# EAGLE design schematic (EAGLE 8.3.2)
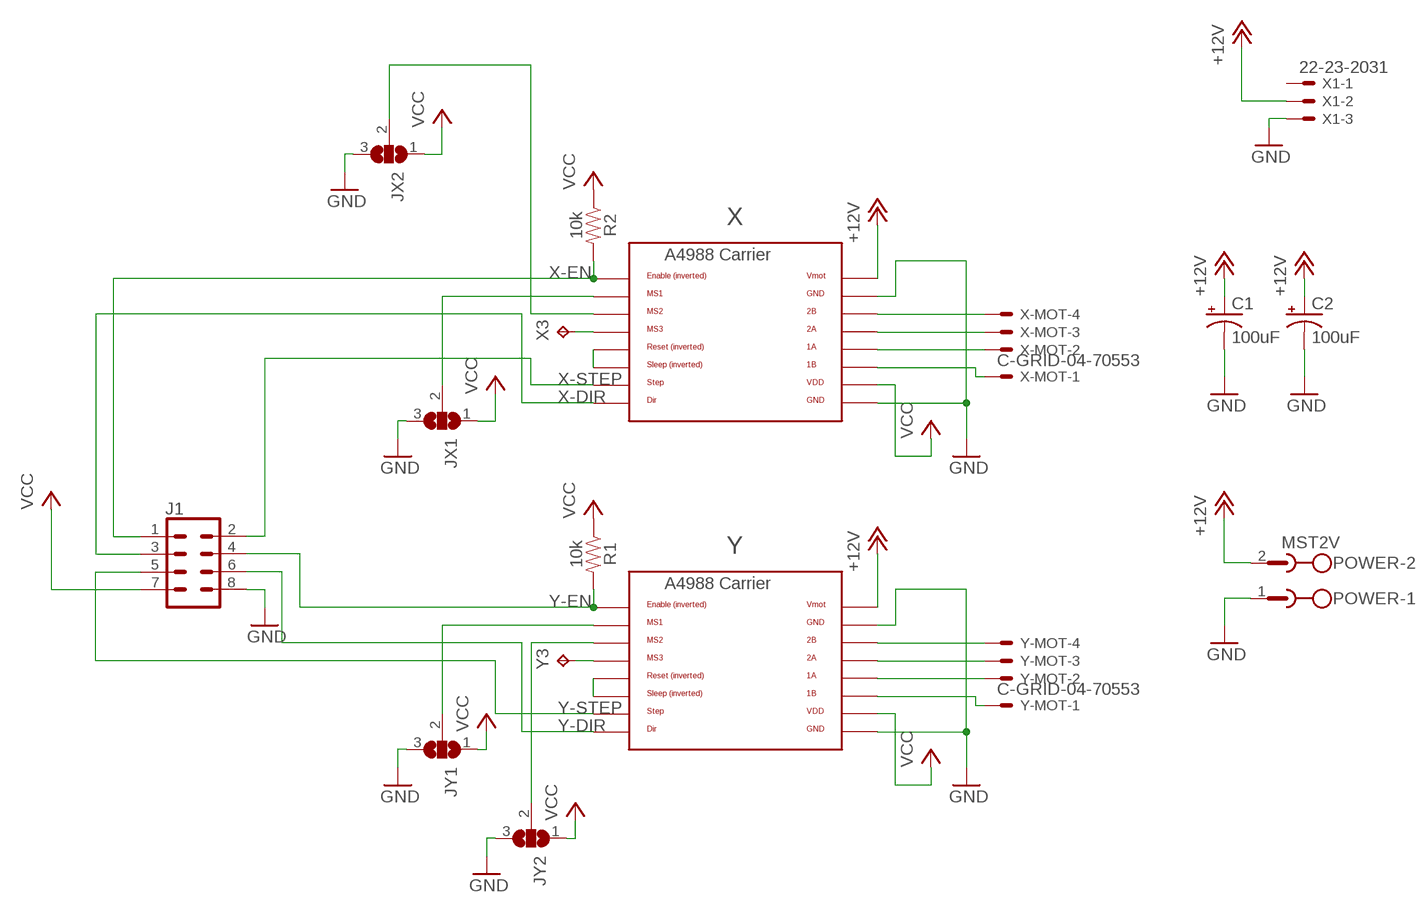
[diagram p0: schematic, sheet 1]

## Parts
C1  100uF  100UF-POLAR-RADIAL-2.5MM-25V-20%  [CPOL-RADIAL-2.5MM-6.5MM]
C2  100uF  100UF-POLAR-RADIAL-2.5MM-25V-20%  [CPOL-RADIAL-2.5MM-6.5MM]
J1  CONN_04X2  [2X4]
JX1  SJ2W  [SJ_2]
JX2  SJ2W  [SJ_2]
JY1  SJ2W  [SJ_2]
JY2  SJ2W  [SJ_2]
POWER  MST2V  [MSTBV2]
R1  10k  10KOHM-HORIZ-1/4W-1%  [AXIAL-0.3]
R2  10k  10KOHM-HORIZ-1/4W-1%  [AXIAL-0.3]
U$1  A4988BREAKOUT  [A4988BREAKOUT]
U$4  A4988BREAKOUT  [A4988BREAKOUT]
X1  22-23-2031  [22-23-2031]
X3  TPB1,27  [B1,27]
X-MOT  C-GRID-04-70553  [70553-04]
Y3  TPB1,27  [B1,27]
Y-MOT  C-GRID-04-70553  [70553-04]

## Nets
+12V: C1.1(+) C2.1(+) POWER.2 U$1.VMOT U$4.VMOT X1.2
GND: C1.2(-) C2.2(-) J1.8 JX1.3 JX2.3 JY1.3 JY2.3 POWER.1 U$1.GND U$1.GND@0(GND) U$4.GND U$4.GND@0(GND) X1.3
N$1: JY2.2 U$4.MS2
N$2: U$4.MS3 Y3.TP
N$3: U$4.2B Y-MOT.4
N$4: U$4.2A Y-MOT.3
N$5: U$1.RST U$1.SLP(SLEEP)
N$6: U$1.2B X-MOT.4
N$7: U$1.2A X-MOT.3
N$8: U$4.RST U$4.SLP(SLEEP)
N$9: U$1.1A X-MOT.2
N$10: U$4.1A Y-MOT.2
N$11: U$4.1B Y-MOT.1
N$12: U$1.1B X-MOT.1
N$13: JX2.2 U$1.MS2
N$14: U$1.MS3 X3.TP
N$15: JX1.2 U$1.MS1
N$16: JY1.2 U$4.MS1
VCC: J1.7 JX1.1 JX2.1 JY1.1 JY2.1 R1.P$1 R2.P$1 U$1.VDD U$4.VDD
X-DIR: J1.3 U$1.DIR
X-EN: J1.1 R2.P$2 U$1.EN
X-STEP: J1.2 U$1.STEP
Y-DIR: J1.6 U$4.DIR
Y-EN: J1.4 R1.P$2 U$4.EN
Y-STEP: J1.5 U$4.STEP
Unconnected: X1.1

## Notes on the sheet
- X
- Y

## Library data of the parts
C1 C2 = SparkFun-Capacitors:100UF-POLAR: 100µF polarized capacitors A capacitor is a passive two-terminal electrical component used to store electrical energy temporarily in an electric field.; PROD_ID: CAP-08439
J1 = SparkFun-Connectors:CONN_04X2: Multi connection point. Often used as Generic Header-pin footprint for 0.1 inch spaced/style header connections On any of the 0.1 inch spaced packages, you can populate with these: Break Away Headers - Straight <https://www.sparkfun.com/products/116> (PRT-00116) Break Away Male Headers - Right Angle <https://www.sparkfun.com/products/553> (PRT-00553) Female Headers <https://www.sparkfun.com/products/115> (PRT-00115) Break Away Headers - Machine Pin <https://www.sparkfun.com/products/117> (PRT-00117) Break Away Female Headers - Swiss Machine Pin <https://www.sparkfun.com/products/743> (PRT-00743)
JX1 JX2 JY1 JY2 = jumper:SJ2W: SMD solder JUMPER
POWER = con-phoenix-508:MST2V: PHOENIX; OC_FARNELL: unknown; OC_NEWARK: unknown
R1 R2 = SparkFun-Resistors:10KOHM: 10kΩ resistor A resistor is a passive two-terminal electrical component that implements electrical resistance as a circuit element. Resistors act to reduce current flow, and, at the same time, act to lower voltage levels within circuits. - Wikipedia; PROD_ID: RES-12183
U$1 U$4 = RepRapjr:A4988BREAKOUT
X1 = con-molex:22-23-2031: .100" (2.54mm) Center Header - 3 Pin; MF: MOLEX; MPN: 22-23-2031; OC_FARNELL: 1462950; OC_NEWARK: 30C0862
X3 Y3 = testpad:TP: Test pad
X-MOT Y-MOT = con-molex:C-GRID-04: CONNECTOR wire to board 2.54 mm (0.100") pitch header; OC_FARNELL: unknown; OC_NEWARK: unknown

## Board
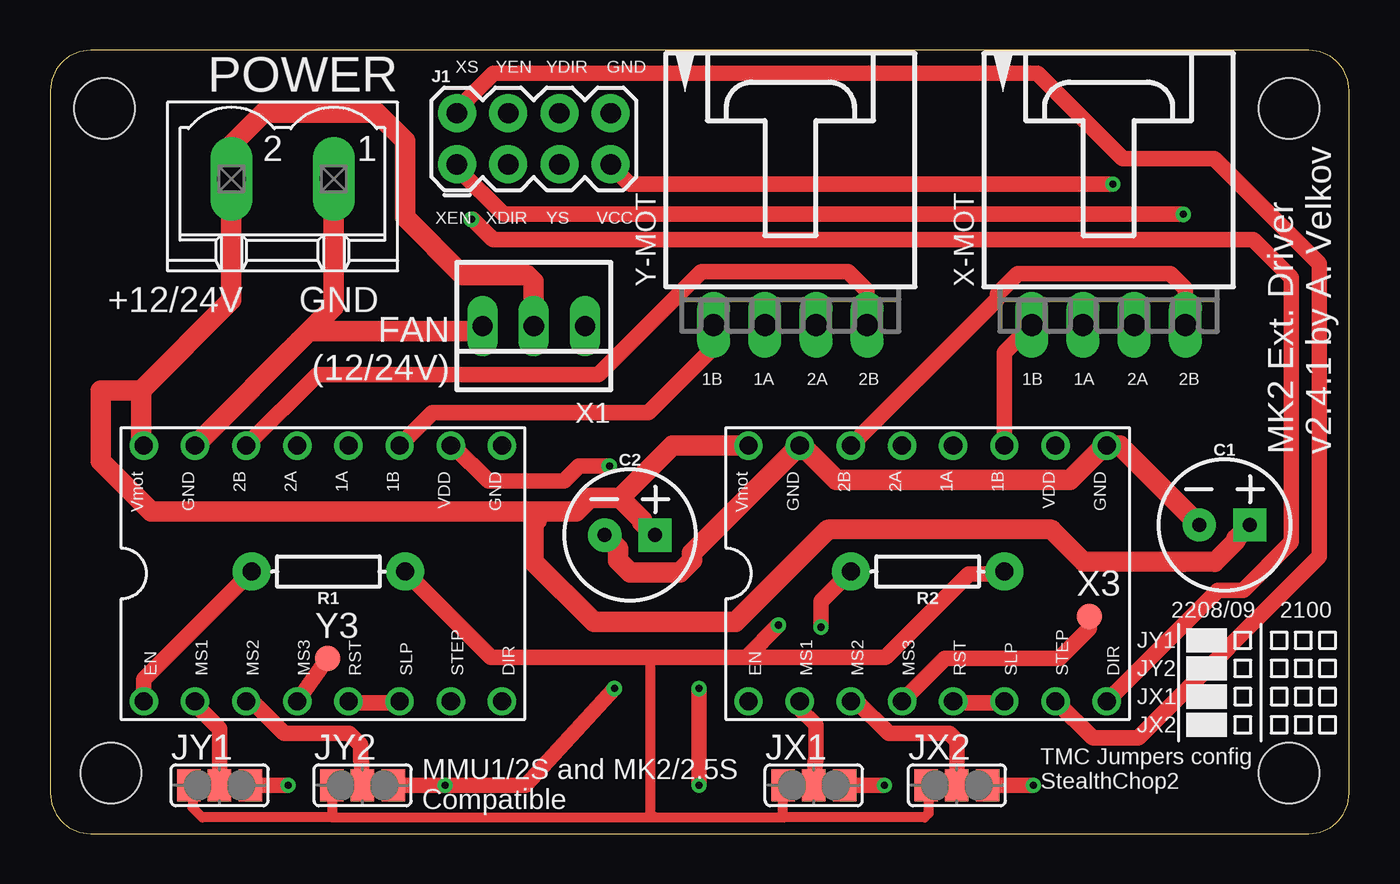
[diagram p1: board, top side]
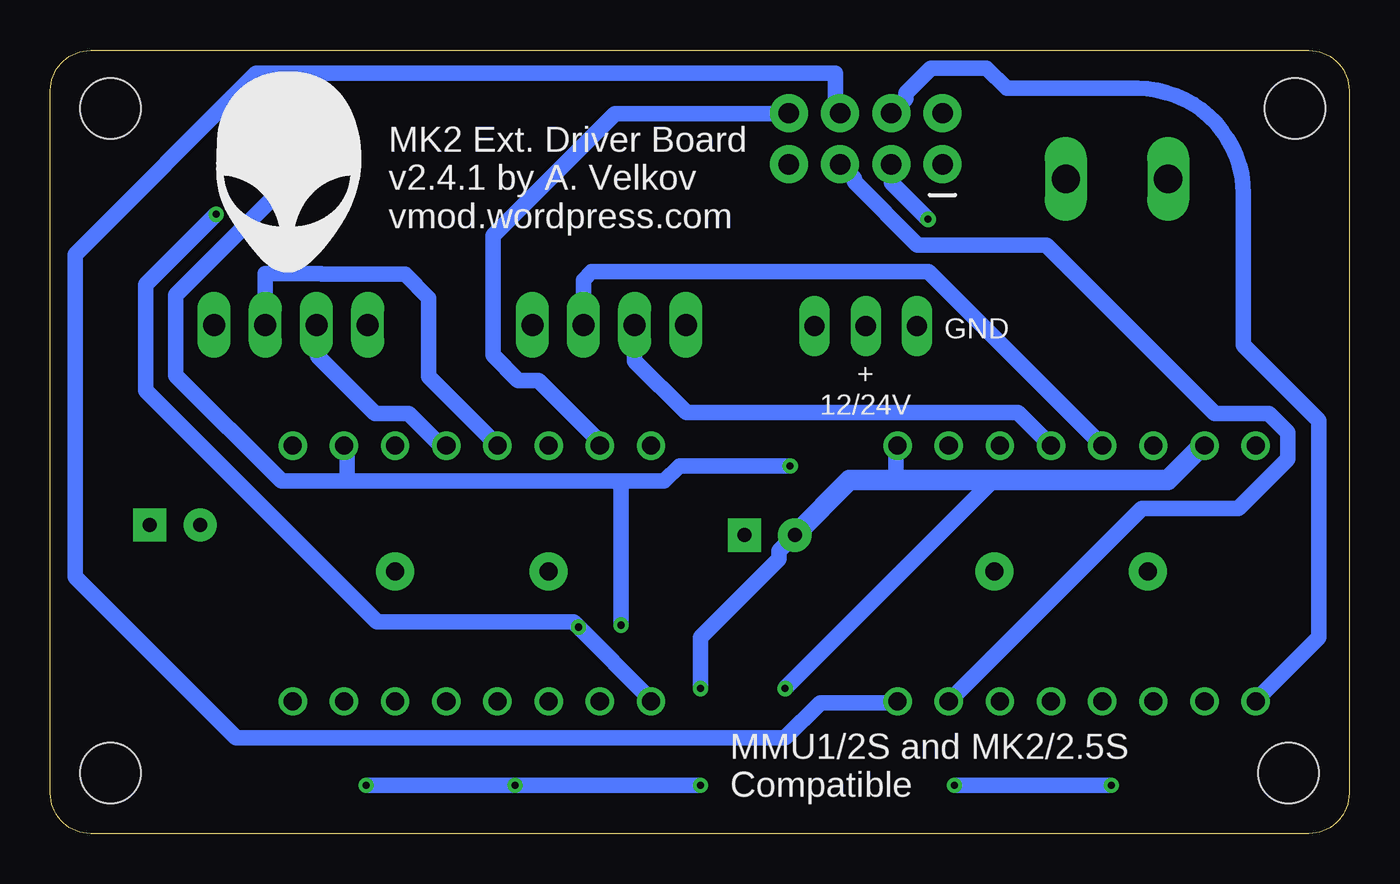
[diagram p2: board, bottom side, seen from below]

Size 64.48 x 38.89 mm. Coordinates in mm from the lower left corner, seen from the top.
Outline: 0,36.89 0,2 arc90 2,0 62.48,0 arc90 64.48,2 64.48,36.89 arc90 62.48,38.89 2,38.89 arc90 0,36.89
Copper layers (1*16): Top 0.035mm / dielectric 1.5mm / Bottom 0.035mm
Design rules "default *": minimum track width 30mil, minimum drill 0.35mm, track to track 20mil, track to pad 20mil, pad to pad 20mil, via to via 20mil, smd to smd 20mil, copper to edge 20mil, drill to drill 20mil, minimum pad ring 10mil, minimum via ring 8mil, stop-mask expansion 4mil, vias tented up to drill 20mil, thermal gap 10mil
Holes 3 mm at 3,3 61.5,36 2.67,36 61.5,3

### Footprints (pad centres in the part's own frame; a part is rotated, then mirrored left to right if it is on the bottom)
CPOL-RADIAL-2.5MM-6.5MM = drill 0.7 pad 1.651 square: 1 1.25,0 | drill 0.7 pad 1.651: 2 -1.25,0
2X4 = drill 1.016 pad 1.88: 1 -3.81,-1.27; 2 -3.81,1.27; 3 -1.27,-1.27; 4 -1.27,1.27; 5 1.27,-1.27; 6 1.27,1.27; 7 3.81,-1.27; 8 3.81,1.27
SJ_2 = smd 1.168 x 1.6: 1 -1.524,0; 2 0,0; 3 1.524,0
MSTBV2 = drill 1.397 long: 1 -2.54,0; 2 2.54,0
AXIAL-0.3 = drill 0.9 pad 1.88: P$1 -3.81,0; P$2 3.81,0
A4988BREAKOUT = drill 0.9: 1A 8.89,1.27; 1B 11.43,1.27; 2A 6.35,1.27; 2B 3.81,1.27; DIR 16.51,-11.43; EN -1.27,-11.43; GND 16.51,1.27; GND@0 1.27,1.27; MS1 1.27,-11.43; MS2 3.81,-11.43; MS3 6.35,-11.43; RST 8.89,-11.43; SLP 11.43,-11.43; STEP 13.97,-11.43; VDD 13.97,1.27; VMOT -1.27,1.27
22-23-2031 = drill 1 long: 1 -2.54,0; 2 0,0; 3 2.54,0
B1,27 = smd 1.27 x 1.27: TP 0,0
70553-04 = drill 1.092 long: 1 -3.81,-7.62; 2 -1.27,-7.62; 3 1.27,-7.62; 4 3.81,-7.62

### Placement (x,y rotation side)
C1  58.29,15.32 0 top
C2  28.77,14.82 0 top
J1  24,34.5 0 top
JX1  37.9,2.4 0 top
JX2  45,2.4 0 top
JY1  8.4,2.4 0 top
JY2  15.5,2.4 0 top
POWER  11.53,32.51 180 top
R1  13.8,13.01 180 top
R2  43.55,13.01 180 top
U$1  35.93,18 0 top
U$4  5.91,18 0 top
X1  24,25.2 180 top
X3  51.58,10.79 0 top
X-MOT  52.53,32.87 0 top
Y3  13.76,8.69 0 top
Y-MOT  36.74,32.87 0 top

### Tracks (layer width: path | path; a pad name or v marks a point on that pad's centre or on a via)
+12V
  Top 0.762: 24.25,16 24.25,15.5
  Top 1: C1.1 58.87,14.65 58.87,14.56 57.8,13.49 56.28,13.49 56.27,13.5 51.3,13.5 49.7,15.1 38.6,15.1 38.5,15
  Top 1.016: 4.5,22 8.98,26.48 POWER.2 8.98,34.19 10.6,35.8 16.2,35.8 17.6,34.4 17.6,30.6 20.48,27.72 23.68,27.72 24,27.4 X1.2 | 4.5,22 4.5,19.41 U$4.VMOT | 4.5,22 2.5,22 2.5,18.5 5,16 24,16 | 24,16 24.25,16 26.1,16 26.76,16.66 28.28,16.66 | 28.28,16.66 29.36,15.58 29.36,15.48 C2.1 | 28.28,16.66 30.89,19.27 U$1.VMOT | 24,16 24,13.5 27,10.5 34,10.5 38.5,15
GND  (via drill 0.35)
  Top 0.762: v28,7.2 23.6,2.4 v19.6,2.4 JY2.3 | JY1.3 v11.8,2.4 | v32.2,7.2 v32.2,2.4 | v41.4,2.4 JX1.3 | JX2.3 v48.8,2.4
  Top 1.016: C2.2 28.18,14.16 28.18,13.57 28.77,12.98 31.27,12.98 31.86,13.57 31.86,13.93 U$1.GND@0 37.31,19.27 39.03,17.55 50.61,17.55 52.33,19.27 U$1.GND 53.09,19.27 C1.2 | POWER.1 14.06,26.15 12.86,24.94 | 12.86,24.94 U$4.GND@0 | X1.3 21.46,24.94 12.86,24.94
  Bottom 0.762: 22.5,17.55 22.5,19.25 U$4.GND | J1.8 28,35.75 36.45,35.75 42.5,29.7 42.5,23.75 41.25,22.5 40.25,22.5 37.25,19.5 U$1.GND@0 | 9.01,17.55 17.66,17.55 v28,7.2 | v11.8,2.4 v19.6,2.4 | C2.2 28.3,14.03 28.3,13.63 32.2,9.73 v32.2,7.2 | v32.2,2.4 v41.4,2.4 v48.8,2.4
  Bottom 1.016: U$4.GND@0 7.29,19.27 9.01,17.55 22.5,17.55 24.8,17.55 C2.2
N$1
  Top 0.762: U$4.MS2 10.01,6.57 11.6,4.97 14.83,4.97 15.4,4.4 15.4,3.62 15.45,3.57 15.45,2.45 JY2.2
N$2
  Top 0.762: U$4.MS3 12.96,7.59 Y3.TP
N$3
  Top 0.762: U$4.2B 13.26,22.8 27.22,22.8 32.32,27.9 39.6,27.9 40.55,26.95 Y-MOT.4
N$4
  Bottom 0.762: U$4.2A 20.89,27.9 37.6,27.9 38.01,27.49 Y-MOT.3
N$5
  Top 0.762: U$1.RST 45,6.5 47.25,6.5 U$1.SLP
N$6
  Top 0.762: U$1.2B 47.02,26.54 47.02,26.78 48.04,27.8 55.6,27.8 56.34,27.05 X-MOT.4
N$7
  Bottom 0.762: U$1.2A 45.7,22.68 45.7,26.6 46.88,27.78 51,27.78 51.02,27.8 53.8,27.8 X-MOT.3
N$8
  Top 0.762: U$4.RST 15,6.5 17.25,6.5 U$4.SLP
N$9
  Bottom 0.762: U$1.1A 45.11,19.27 46.7,20.86 48.36,20.86 51.2,23.7 51.2,25.18 X-MOT.2
N$10
  Bottom 0.762: U$4.1A 16.43,20.9 32.9,20.9 35.47,23.47 Y-MOT.2
N$11
  Top 0.762: U$4.1B 18.98,20.9 29.7,20.9 32.93,24.13 Y-MOT.1
N$12
  Top 0.762: U$1.1B 47.36,23.89 X-MOT.1
N$13
  Top 0.762: U$1.MS2 40.03,6.57 41.62,4.97 44.63,4.97 45,4.6 JX2.2
N$14
  Top 0.762: U$1.MS3 44.41,8.7 50.1,8.7 51.58,10.18 X3.TP
N$15
  Top 0.762: U$1.MS1 37.2,6.2 38,5.4 38,3.62 37.95,3.57 37.95,2.45 JX1.2
N$16
  Top 0.762: U$4.MS1 7.18,6.42 8.4,5.2 JY1.2
VCC  (via drill 0.35)
  Top 0.508: JX2.1 43.6,2.28 43.6,1 43.4,0.8 36.4,0.8 | 36.4,0.8 36.38,0.82 JX1.1 | 30,0.8 36.4,0.8 | 30,0.8 29.8,1 29.8,8.75 | JY1.1 7.05,2.22 7.05,1.28 7.54,0.8 14,0.8 | 14,0.8 30,0.8 | JY2.1 14,2.38 14,0.8
  Top 0.762: v27.75,18.25 26.25,18.25 25.5,17.5 21.75,17.5 20,19.25 U$4.VDD | v52.75,32.25 28.75,32.25 28,33 J1.7 | 13.8,2.22 JY2.1 | JX1.1 36.43,2.35 | R1.P$1 21.87,8.75 29.8,8.75 34.4,8.75 | R2.P$1 47.25,12.9 45.6,12.9 41.45,8.75 34.4,8.75 | 34.4,8.75 34.55,8.75 v36.15,10.35
  Bottom 0.762: v27.75,18.25 33.25,18.25 34,17.5 36.4,17.5 | 36.4,17.5 49.75,17.5 | 49.75,17.5 49.75,19.25 U$1.VDD | v52.75,32.25 58.25,26.75 58.25,22.75 53,17.5 49.75,17.5 | v36.15,10.35 36.15,17.25 36.4,17.5
X-DIR  (via drill 0.35)
  Top 0.762: U$1.DIR 57.96,12.08 59.21,12.08 61.6,14.47 61.6,27.6 59.72,29.48 21.97,29.48 20.95,30.5 v20.9,30.5
  Bottom 0.762: v20.9,30.5 22.73,32.33 J1.3
X-EN  (via drill 0.35)
  Top 0.762: v56.25,30.75 22.5,30.75 20.25,33 J1.1 | v38.25,10.25 38.25,11.52 R2.P$2
  Bottom 0.762: U$1.EN 34.75,6.75 v38.25,10.25 38.5,10.5 48.25,10.5 59.75,22 59.75,27.25 v56.25,30.75
X-STEP
  Top 0.762: 52.88,33.88 49,37.75 22,37.75 20.25,36 J1.2 | 52.88,33.88 53.25,33.5 | U$1.STEP 50,6.5 51.75,4.75 54,4.75 63,13.75 63,28.3 57.78,33.52 53.23,33.52 52.88,33.88
Y-DIR
  Bottom 0.762: 63.25,14.5 63.25,28.75 54.25,37.75 25.5,37.75 25.5,36 J1.6 | 63.25,14.5 63.25,14 | U$4.DIR 22.5,6.5 26.25,6.5 28,4.75 55.25,4.75 | 55.25,4.75 55.5,5 | 55.25,4.75 63.25,12.75 63.25,14.5
Y-EN
  Top 0.762: U$4.EN 4.64,7.66 R1.P$2
  Bottom 0.762: J1.4 22,36.5 22,36.75 20.75,38 18,38 17,37 10.5,37 arc90 5.25,31.75 5.25,24.25 1.5,20.5 1.5,9.75 4.5,6.75 U$4.EN
Y-STEP
  Bottom 0.762: J1.5 24.56,32.52 24.56,32.36 21.43,29.23 15.03,29.23 6.66,20.86 3.98,20.86 3.05,19.93 3.05,18.61 5.5,16.15 10.3,16.15 U$4.STEP

### Text on the board
tPlace: XS | YEN | YDIR | GND | XEN | XDIR | YS | VCC | +12/24V | GND | FAN / (12/24V) | 1B | 1A | 2A | 2B | 1B | 1A | 2A | 2B | MK2 Ext. Driver / v2.4.1 by A. Velkov | 2208/09 | 2100 | JY1 | JY2 | JX1 | JX2 | TMC Jumpers config / StealthChop2 | MMU1/2S and MK2/2.5S / Compatible
bPlace: MK2 Ext. Driver Board / v2.4.1 by A. Velkov / vmod.wordpress.com | GND | + / 12/24V | MMU1/2S and MK2/2.5S / Compatible | C:/Users/antonio velkov.DUNDEE/Google Drive/Sega/MegaMod/alien-head-stencle.bmp